# EAGLE design EuroESP32 (EAGLE 9.6.2)
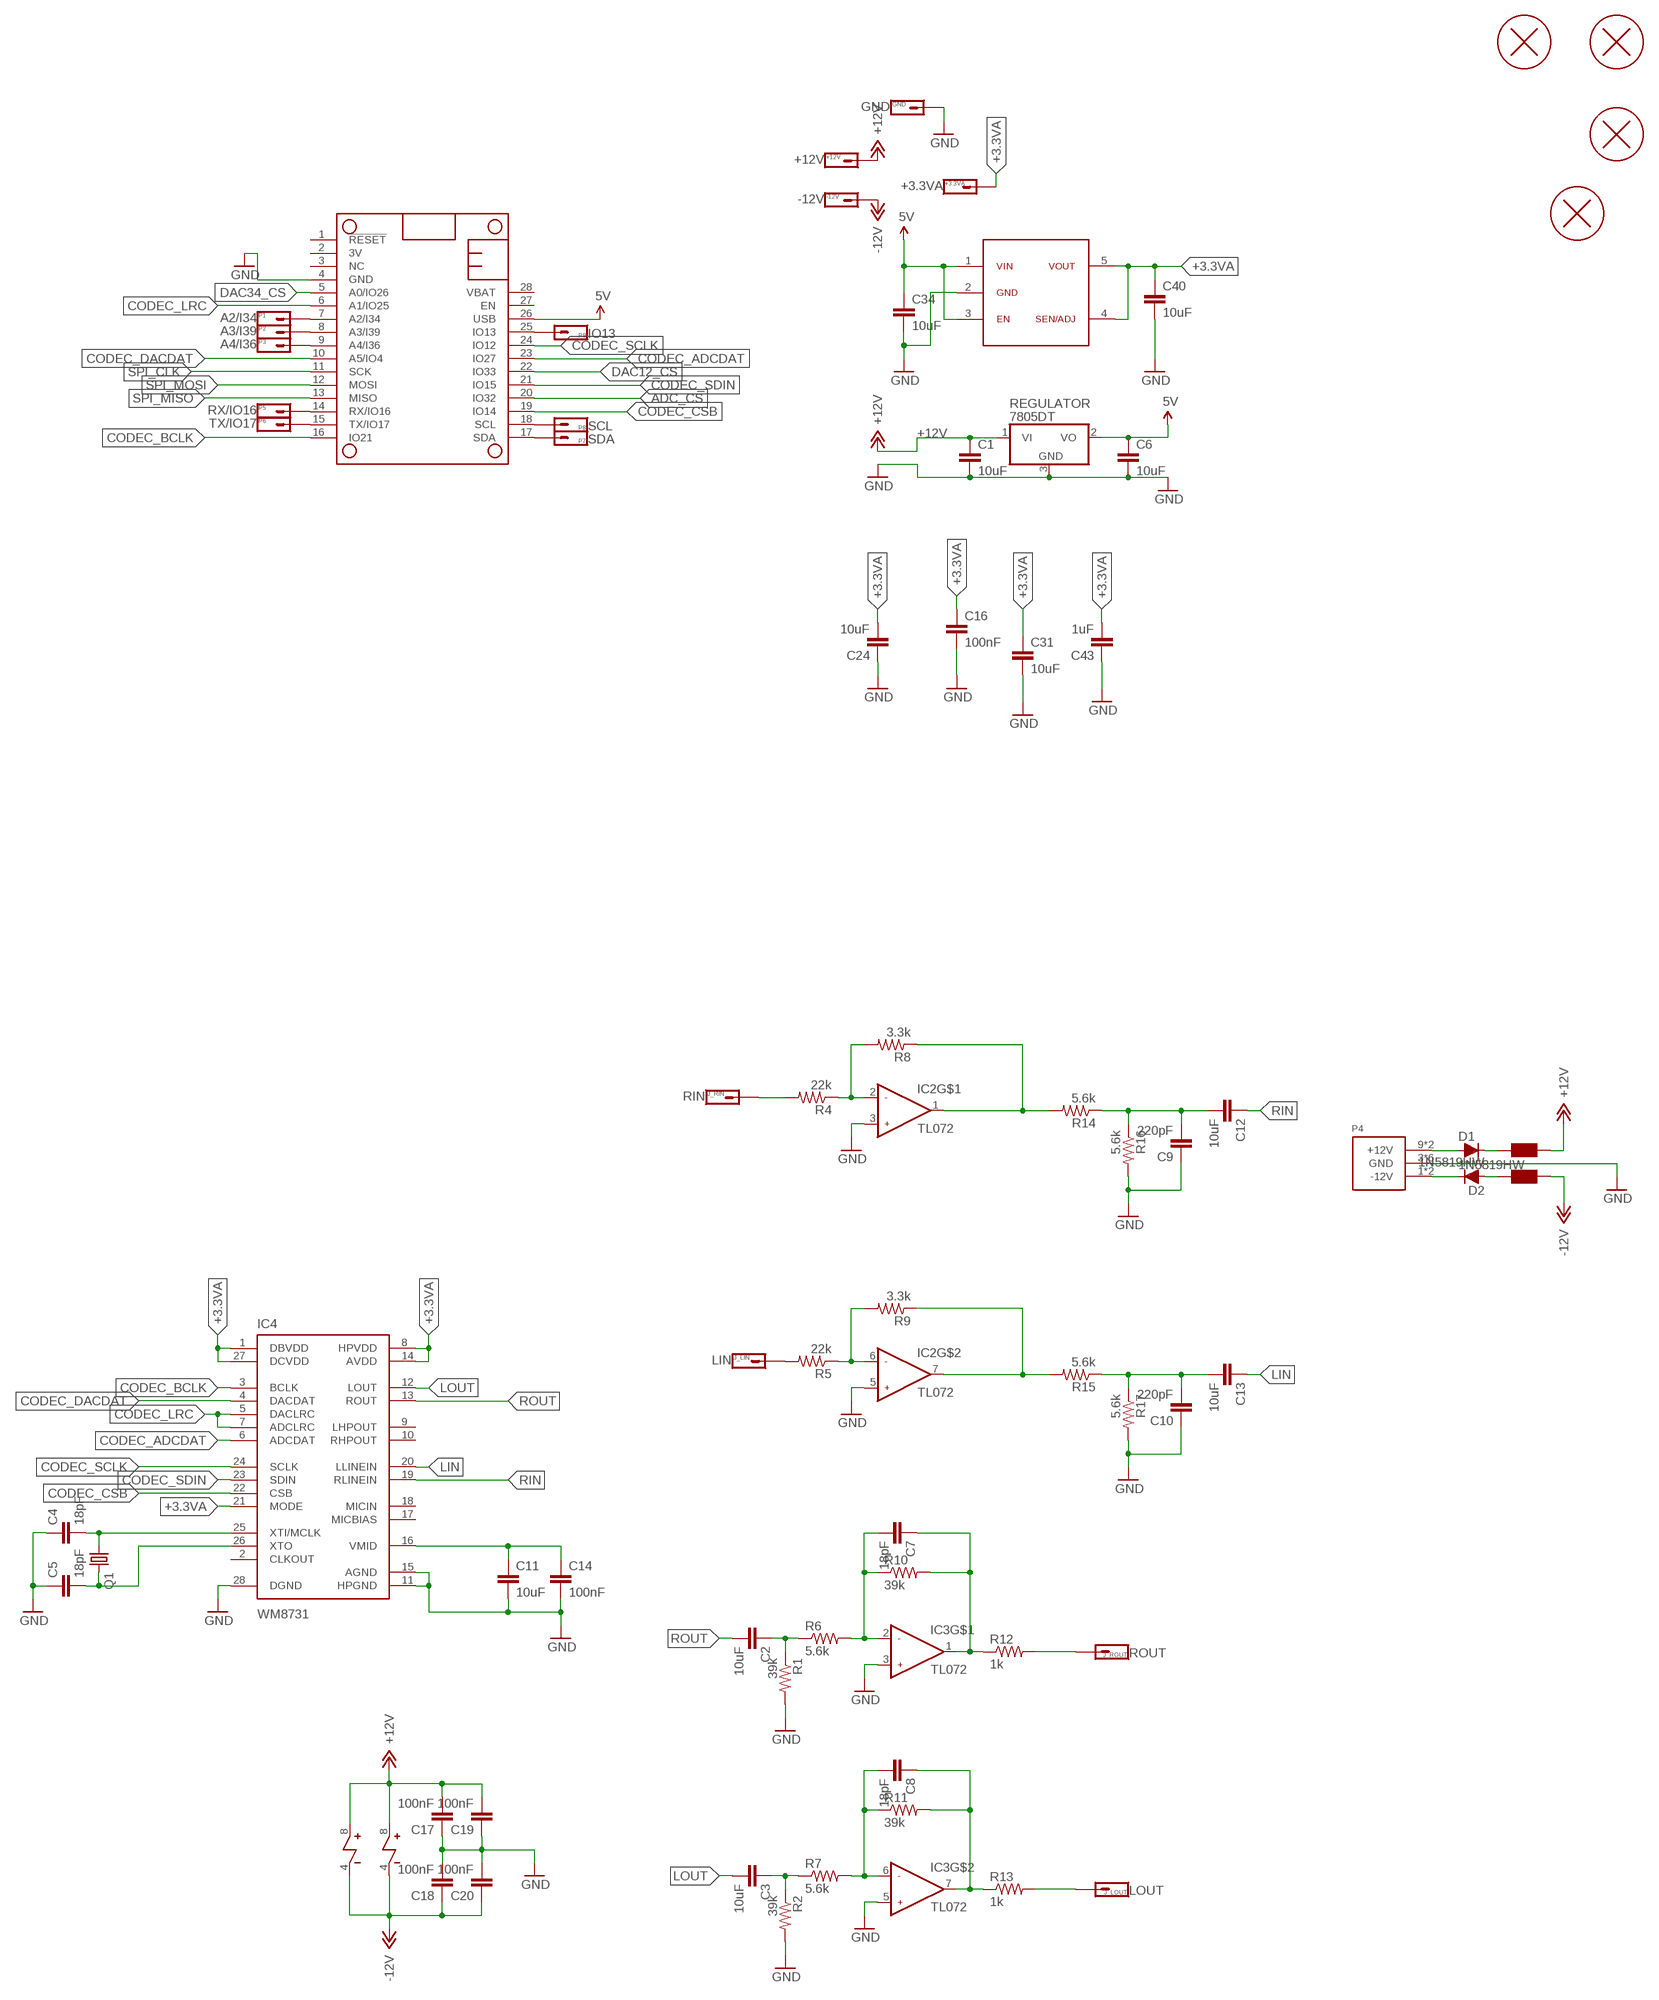
[diagram p0: schematic, sheet 1, part 1 of 2]
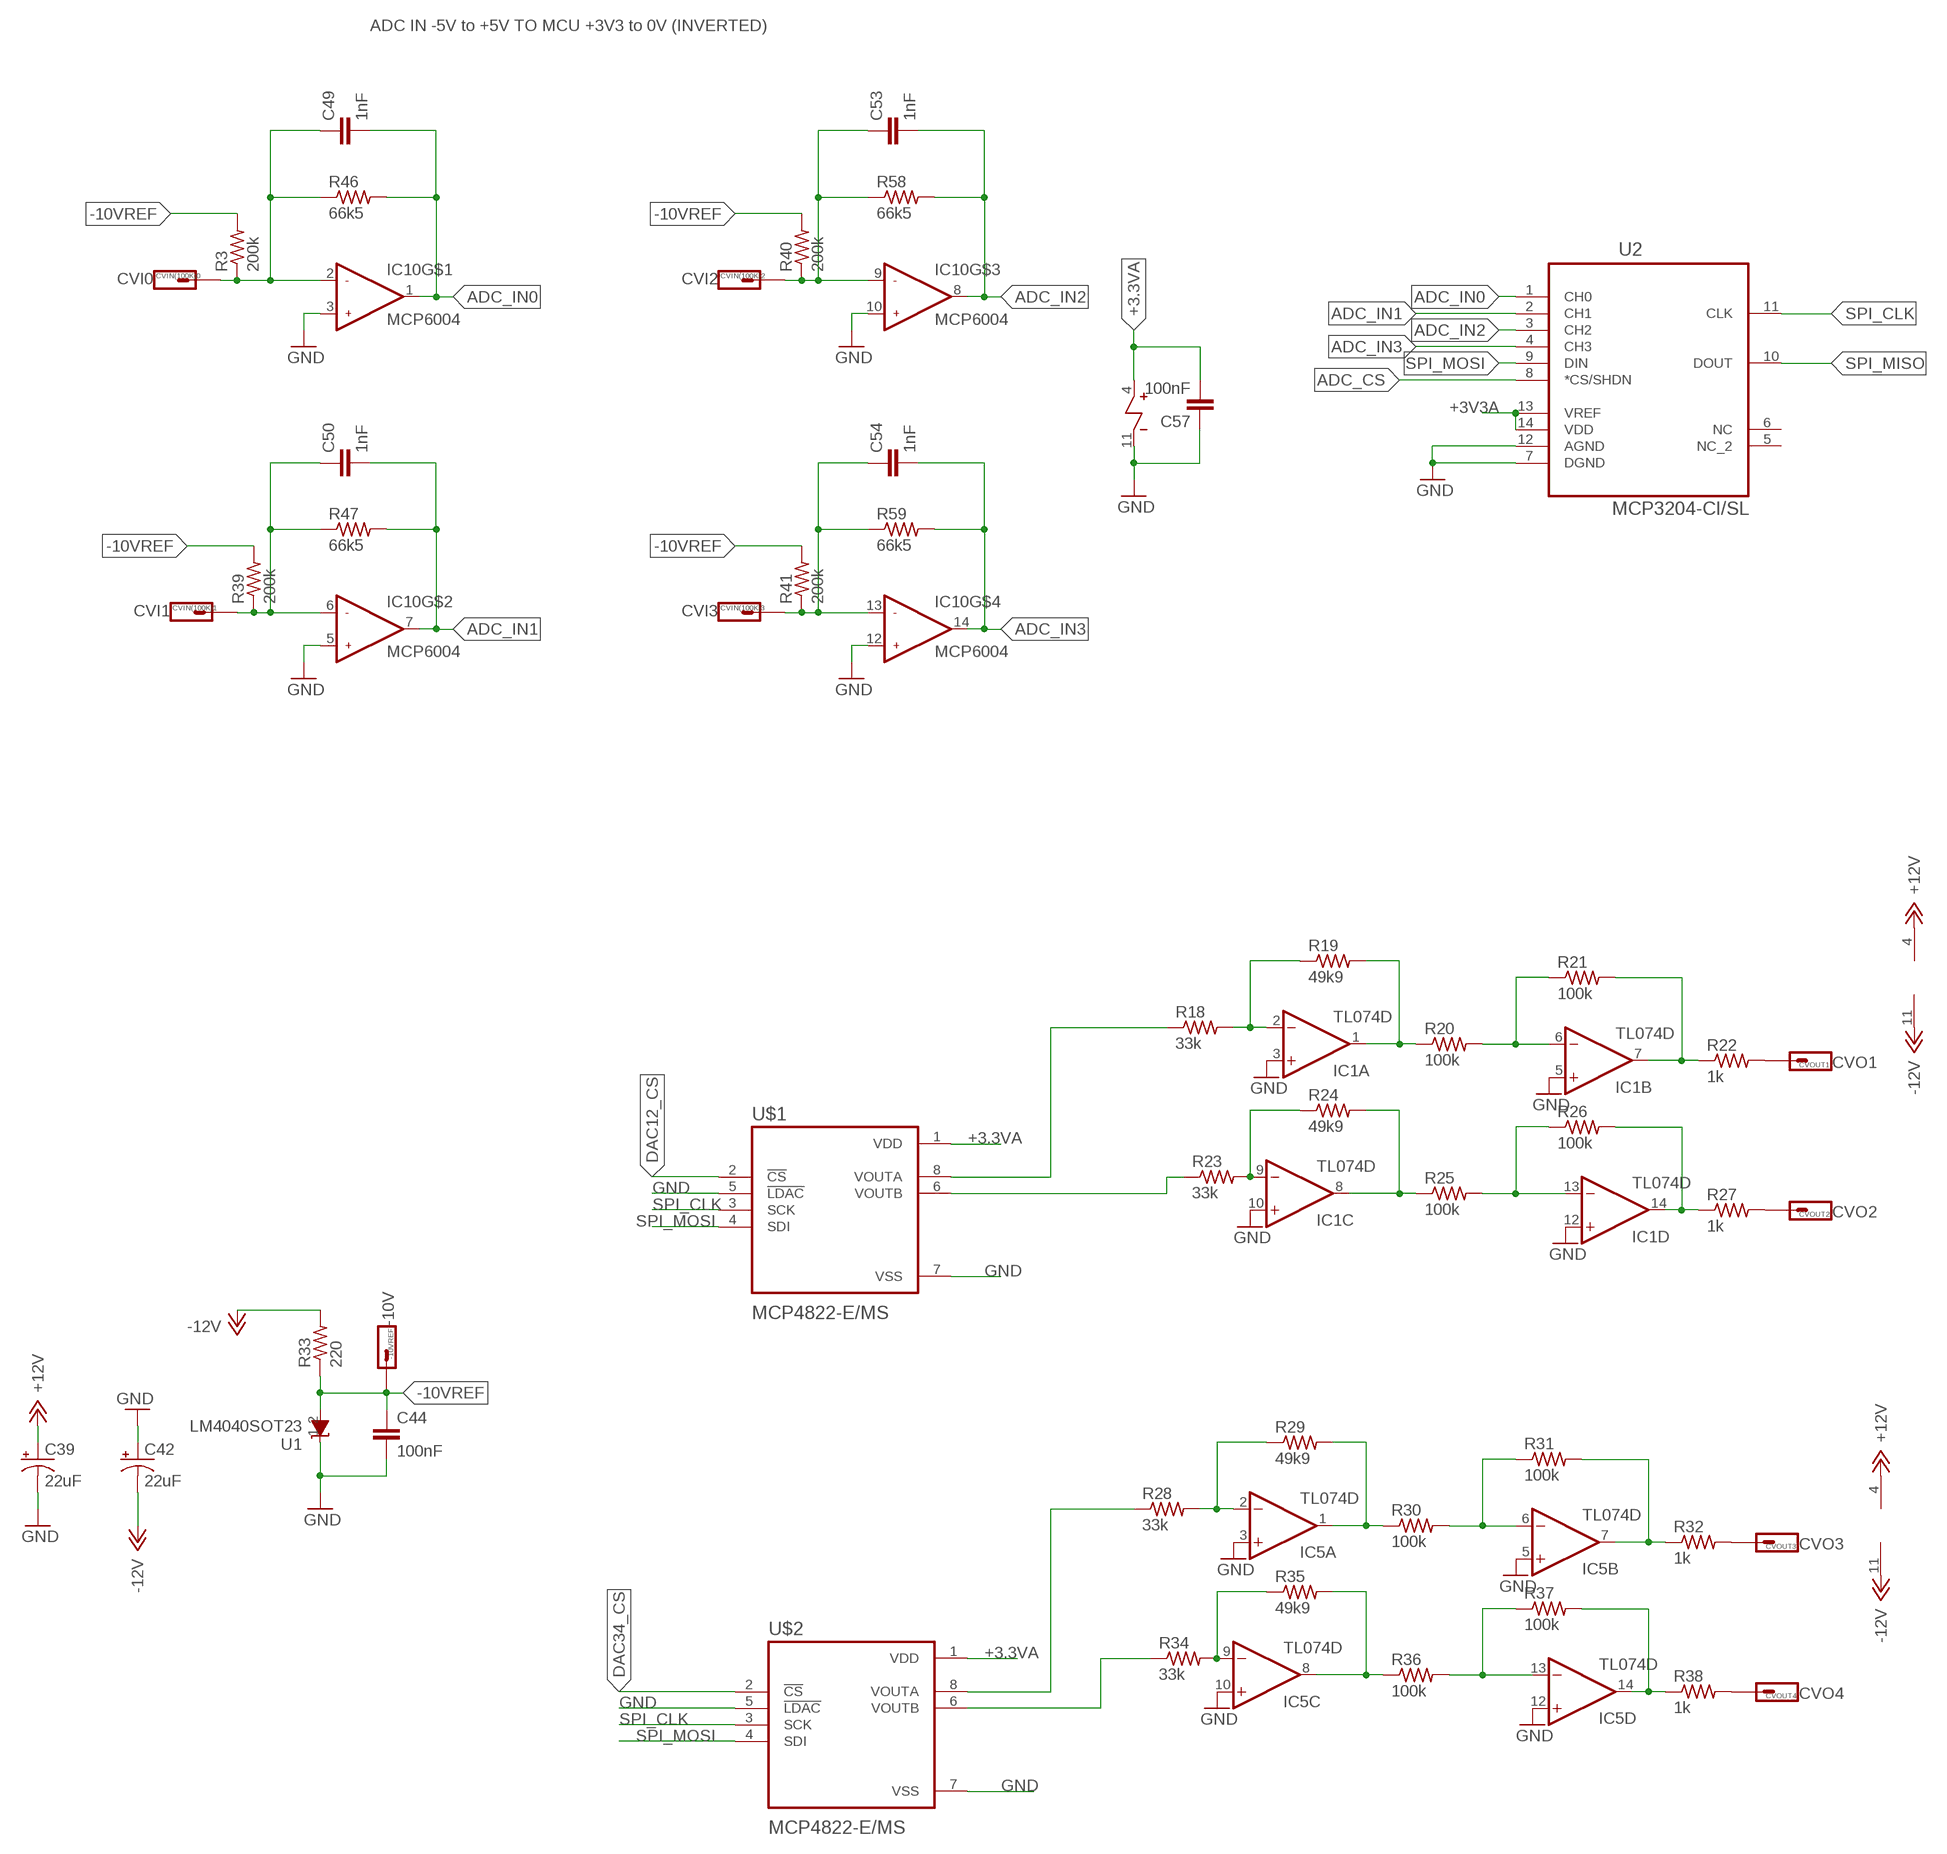
[diagram p1: schematic, sheet 1, part 2 of 2]

## Parts
+3.3VA  +3.3VA  HEADER-1X1  [1X01_SIDE_NAME]
+12V  +12V  HEADER-1X1  [1X01_SIDE_NAME]
-10VREF  -10V  HEADER-1X1  [1X01_SIDE_NAME]
-12V  -12V  HEADER-1X1  [1X01_SIDE_NAME]
C1  10uF  CAPACITOR1210  [R1210]
C2  10uF  CAPACITOR0805  [R0805]
C3  10uF  CAPACITOR0805  [R0805]
C4  18pF  CAPACITOR  [RESISTOR_0603]
C5  18pF  CAPACITOR  [RESISTOR_0603]
C6  10uF  CAPACITOR1210  [R1210]
C7  18pF  CAPACITOR  [RESISTOR_0603]
C8  18pF  CAPACITOR  [RESISTOR_0603]
C9  220pF  CAPACITOR  [RESISTOR_0603]
C10  220pF  CAPACITOR  [RESISTOR_0603]
C11  10uF  CAPACITOR0805  [R0805]
C12  10uF  CAPACITOR0805  [R0805]
C13  10uF  CAPACITOR0805  [R0805]
C14  100nF  CAPACITOR  [RESISTOR_0603]
C16  100nF  CAPACITOR  [RESISTOR_0603]
C17  100nF  CAPACITOR  [RESISTOR_0603]
C18  100nF  CAPACITOR  [RESISTOR_0603]
C19  100nF  CAPACITOR  [RESISTOR_0603]
C20  100nF  CAPACITOR  [RESISTOR_0603]
C24  10uF  CAPACITOR0805  [R0805]
C31  10uF  CAPACITOR0805  [R0805]
C34  10uF  CAPACITOR1210  [R1210]
C39  22uF  CAP_POL1206_TANT  [1206_POL]
C40  10uF  CAPACITOR0805  [R0805]
C42  22uF  CAP_POL1206_TANT  [1206_POL]
C43  1uF  CAPACITOR  [RESISTOR_0603]
C44  100nF  CAPACITOR  [RESISTOR_0603]
C49  1nF  CAPACITOR  [RESISTOR_0603]
C50  1nF  CAPACITOR  [RESISTOR_0603]
C53  1nF  CAPACITOR  [RESISTOR_0603]
C54  1nF  CAPACITOR  [RESISTOR_0603]
C57  100nF  CAPACITOR  [RESISTOR_0603]
CVIN(100K)0  CVI0  HEADER-1X1  [1X01_SIDE_NAME]
CVIN(100K)1  CVI1  HEADER-1X1  [1X01_SIDE_NAME]
CVIN(100K)2  CVI2  HEADER-1X1  [1X01_SIDE_NAME]
CVIN(100K)3  CVI3  HEADER-1X1  [1X01_SIDE_NAME]
CVOUT1  CVO1  HEADER-1X1  [1X01_SIDE_NAME]
CVOUT2  CVO2  HEADER-1X1  [1X01_SIDE_NAME]
CVOUT3  CVO3  HEADER-1X1  [1X01_SIDE_NAME]
CVOUT4  CVO4  HEADER-1X1  [1X01_SIDE_NAME]
D1  1N5819HW  DIODE  [SOD123]
D2  1N5819HW  DIODE  [SOD123]
F1  Würth Electronics 742792664  FERRITE-BEAD0805  [R0805]
F2  Würth Electronics 742792664  FERRITE-BEAD0805  [R0805]
GND  GND  HEADER-1X1  [1X01_SIDE_NAME]
H1  PCB_SCREW  [PCB_SCREW]
H3  PCB_SCREW  [PCB_SCREW]
H4  PCB_SCREW  [PCB_SCREW]
H5  PCB_SCREW  [PCB_SCREW]
IC1  TL074D  [SO14]
IC2  TL072  OPAMP_DUAL  [SOIC8]
IC3  TL072  OPAMP_DUAL  [SOIC8]
IC4  WM8731  [SSOP28]
IC5  TL074D  [SO14]
IC7  ADP7118  [SOT23-5L]
IC10  MCP6004  OPAMP_QUADPWR  [TSSOP14]
J_LIN  LIN  HEADER-1X1  [1X01_SIDE_NAME]
J_LOUT  LOUT  HEADER-1X1  [1X01_SIDE_NAME]
J_RIN  RIN  HEADER-1X1  [1X01_SIDE_NAME]
J_ROUT  ROUT  HEADER-1X1  [1X01_SIDE_NAME]
MS2  FEATHER_HUZZAH32NO_DRILL  [FEATHERWING_NODRILL]
P1  A2/I34  HEADER-1X1  [1X01_SIDE_NAME]
P2  A3/I39  HEADER-1X1  [1X01_SIDE_NAME]
P3  A4/I36  HEADER-1X1  [1X01_SIDE_NAME]
P4  POWER_SIMPLE10  [POWER_10]
P5  RX/IO16  HEADER-1X1  [1X01_SIDE_NAME]
P6  TX/IO17  HEADER-1X1  [1X01_SIDE_NAME]
P7  SDA  HEADER-1X1  [1X01_SIDE_NAME]
P8  SCL  HEADER-1X1  [1X01_SIDE_NAME]
P9  IO13  HEADER-1X1  [1X01_SIDE_NAME]
Q1  CRYSTAL  [HC49UP]
R1  39k  RESISTOR  [RESISTOR_0603]
R2  39k  RESISTOR  [RESISTOR_0603]
R3  200k  RESISTOR  [RESISTOR_0603]
R4  22k  RESISTOR  [RESISTOR_0603]
R5  22k  RESISTOR  [RESISTOR_0603]
R6  5.6k  RESISTOR  [RESISTOR_0603]
R7  5.6k  RESISTOR  [RESISTOR_0603]
R8  3.3k  RESISTOR  [RESISTOR_0603]
R9  3.3k  RESISTOR  [RESISTOR_0603]
R10  39k  RESISTOR  [RESISTOR_0603]
R11  39k  RESISTOR  [RESISTOR_0603]
R12  1k  RESISTOR  [RESISTOR_0603]
R13  1k  RESISTOR  [RESISTOR_0603]
R14  5.6k  RESISTOR  [RESISTOR_0603]
R15  5.6k  RESISTOR  [RESISTOR_0603]
R16  5.6k  RESISTOR  [RESISTOR_0603]
R17  5.6k  RESISTOR  [RESISTOR_0603]
R18  33k  RESISTOR  [RESISTOR_0603]
R19  49k9  RESISTOR  [RESISTOR_0603]
R20  100k  RESISTOR  [RESISTOR_0603]
R21  100k  RESISTOR  [RESISTOR_0603]
R22  1k  RESISTOR  [RESISTOR_0603]
R23  33k  RESISTOR  [RESISTOR_0603]
R24  49k9  RESISTOR  [RESISTOR_0603]
R25  100k  RESISTOR  [RESISTOR_0603]
R26  100k  RESISTOR  [RESISTOR_0603]
R27  1k  RESISTOR  [RESISTOR_0603]
R28  33k  RESISTOR  [RESISTOR_0603]
R29  49k9  RESISTOR  [RESISTOR_0603]
R30  100k  RESISTOR  [RESISTOR_0603]
R31  100k  RESISTOR  [RESISTOR_0603]
R32  1k  RESISTOR  [RESISTOR_0603]
R33  220  RESISTOR  [RESISTOR_0603]
R34  33k  RESISTOR  [RESISTOR_0603]
R35  49k9  RESISTOR  [RESISTOR_0603]
R36  100k  RESISTOR  [RESISTOR_0603]
R37  100k  RESISTOR  [RESISTOR_0603]
R38  1k  RESISTOR  [RESISTOR_0603]
R39  200k  RESISTOR  [RESISTOR_0603]
R40  200k  RESISTOR  [RESISTOR_0603]
R41  200k  RESISTOR  [RESISTOR_0603]
R46  66k5  RESISTOR  [RESISTOR_0603]
R47  66k5  RESISTOR  [RESISTOR_0603]
R58  66k5  RESISTOR  [RESISTOR_0603]
R59  66k5  RESISTOR  [RESISTOR_0603]
REGULATOR  7805DT  [TO252]
U1  LM4040SOT23  [SOT23]
U2  MCP3204-CI/SL  [SOIC127P600X175-14N]
U$1  MCP4822-E/MS  [SOP65P490X110-8N]
U$2  MCP4822-E/MS  [SOP65P490X110-8N]

## Nets
5V: C6.1 C34.1 IC7.1 IC7.3 MS2.26(USB) REGULATOR.2(VO)
+3.3VA: +3.3VA.1 C16.1 C24.2 C31.1 C40.1 C43.2 C57.2 IC4.1(DBVDD) IC4.8(HPVDD) IC4.14(AVDD) IC4.21(MODE) IC4.27(DCVDD) IC7.4 IC7.5 IC10.4 U$1.1(VDD) U$2.1(VDD)
+3V3A: U2.13(VREF) U2.14(VDD)
+12V: +12V.1 C1.1 C17.2 C19.2 C39.2(+) F1.1 IC1.4(P:V+) IC2.8 IC3.8 IC5.4(P:V+) REGULATOR.1(VI)
-10VREF: -10VREF.1 C44.1 R3.2 R33.1 R39.2 R40.2 R41.2 U1.2(A)
-12V: -12V.1 C18.1 C20.1 C42.1(-) F2.1 IC1.11(P:V-) IC2.4 IC3.4 IC5.11(P:V-) R33.2
ADC_CS: MS2.20(IO32) U2.8(*CS/SHDN)
ADC_IN0: C49.2 IC10.1 R46.2 U2.1(CH0)
ADC_IN1: C50.2 IC10.7 R47.2 U2.2(CH1)
ADC_IN2: C53.2 IC10.8 R58.2 U2.3(CH2)
ADC_IN3: C54.2 IC10.14 R59.2 U2.4(CH3)
CODEC_ADCDAT: IC4.6(ADCDAT) MS2.23(IO27)
CODEC_BCLK: IC4.3(BCLK) MS2.16(IO21)
CODEC_CSB: IC4.22(CSB) MS2.19(IO14)
CODEC_DACDAT: IC4.4(DACDAT) MS2.10(A5/IO4)
CODEC_LRC: IC4.5(DACLRC) IC4.7(ADCLRC) MS2.6(A1/IO25)
CODEC_SCLK: IC4.24(SCLK) MS2.24(IO12)
CODEC_SDIN: IC4.23(SDIN) MS2.21(IO15)
DAC12_CS: MS2.22(IO33) U$1.2(!CS)
DAC34_CS: MS2.5(A0/IO26) U$2.2(!CS)
DAC_B: R23.1 U$1.6(VOUTB)
DAC_D: R34.1 U$2.6(VOUTB)
GND: C1.2 C4.1 C5.1 C6.2 C9.1 C10.1 C11.2 C14.2 C16.2 C17.1 C18.2 C19.1 C20.2 C24.1 C31.2 C34.2 C39.1(-) C40.2 C42.2(+) C43.1 C44.2 C57.1 GND.1 IC1.3(A:+IN) IC1.5(B:+IN) IC1.10(C:+IN) IC1.12(D:+IN) IC2.3 IC2.5 IC3.3 IC3.5 IC4.11(HPGND) IC4.15(AGND) IC4.28(DGND) IC5.3(A:+IN) IC5.5(B:+IN) IC5.10(C:+IN) IC5.12(D:+IN) IC7.2 IC10.3 IC10.5 IC10.10 IC10.11 IC10.12 MS2.4(GND) P4.3(GND) P4.4(GND) P4.5(GND) P4.6(GND) P4.7(GND) P4.8(GND) R1.2 R2.2 R16.2 R17.2 REGULATOR.3(GND) U1.1(C) U2.7(DGND) U2.12(AGND) U$1.5(!LDAC) U$1.7(VSS) U$2.5(!LDAC) U$2.7(VSS)
LIN: C13.1 IC4.20(LLINEIN)
LOUT: C3.2 IC4.12(LOUT)
N$1: J_LIN.1 R5.2
N$2: J_LOUT.1 R13.2
N$3: J_ROUT.1 R12.2
N$4: IC1.2(A:-IN) R18.2 R19.1
N$5: IC1.7(B:OUT) R21.2 R22.1
N$6: IC1.9(C:-IN) R23.2 R24.1
N$7: MS2.7(A2/I34) P1.1
N$8: IC1.1(A:OUT) R19.2 R20.1
N$9: IC1.14(D:OUT) R26.2 R27.1
N$10: IC5.6(B:-IN) R30.2 R31.1
N$11: IC1.8(C:OUT) R24.2 R25.1
N$12: IC5.2(A:-IN) R28.2 R29.1
N$13: IC5.7(B:OUT) R31.2 R32.1
N$14: IC5.13(D:-IN) R36.2 R37.1
N$15: C53.1 CVIN(100K)2.1 IC10.9 R40.1 R58.1
N$16: IC5.1(A:OUT) R29.2 R30.1
N$17: C49.1 CVIN(100K)0.1 IC10.2 R3.1 R46.1
N$18: IC5.9(C:-IN) R34.2 R35.1
N$19: C50.1 CVIN(100K)1.1 IC10.6 R39.1 R47.1
N$20: IC5.14(D:OUT) R37.2 R38.1
N$21: C54.1 CVIN(100K)3.1 IC10.13 R41.1 R59.1
N$22: IC1.6(B:-IN) R20.2 R21.1
N$23: IC5.8(C:OUT) R35.2 R36.1
N$24: R18.1 U$1.8(VOUTA)
N$25: CVOUT1.1 R22.2
N$26: R28.1 U$2.8(VOUTA)
N$27: CVOUT2.1 R27.2
N$28: IC1.13(D:-IN) R25.2 R26.1
N$29: CVOUT3.1 R32.2
N$30: MS2.8(A3/I39) P2.1
N$31: J_RIN.1 R4.2
N$32: IC2.2 R4.1 R8.2
N$33: D1.+ P4.9(+12V) P4.10(+12V)
N$34: CVOUT4.1 R38.2
N$35: MS2.9(A4/I36) P3.1
N$36: IC2.1 R8.1 R14.2
N$37: C9.2 C12.2 R14.1 R16.1
N$38: MS2.14(RX/IO16) P5.1
N$39: MS2.15(TX/IO17) P6.1
N$40: IC2.6 R5.1 R9.2
N$41: MS2.17(SDA) P7.1
N$42: IC2.7 R9.1 R15.2
N$43: C5.2 IC4.26(XTO) Q1.2
N$44: C4.2 IC4.25(XTI/MCLK) Q1.1
N$45: C10.2 C13.2 R15.1 R17.1
N$46: C7.1 IC3.1 R10.2 R12.1
N$47: D1.- F1.2
N$48: C7.2 IC3.2 R6.2 R10.1
N$49: C2.1 R1.1 R6.1
N$50: MS2.18(SCL) P8.1
N$51: MS2.25(IO13) P9.1
N$53: D2.- P4.1(-12V) P4.2(-12V)
N$54: C8.1 IC3.7 R11.2 R13.1
N$55: C8.2 IC3.6 R7.2 R11.1
N$56: C11.1 C14.1 IC4.16(VMID)
N$57: C3.1 R2.1 R7.1
N$59: D2.+ F2.2
RIN: C12.1 IC4.19(RLINEIN)
ROUT: C2.2 IC4.13(ROUT)
SPI_CLK: MS2.11(SCK) U2.11(CLK) U$1.3(SCK) U$2.3(SCK)
SPI_MISO: MS2.13(MISO) U2.10(DOUT)
SPI_MOSI: MS2.12(MOSI) U2.9(DIN) U$1.4(SDI) U$2.4(SDI)
Unconnected: IC4.2(CLKOUT) IC4.9(LHPOUT) IC4.10(RHPOUT) IC4.17(MICBIAS) IC4.18(MICIN) MS2.1(!RESET) MS2.2(3V) MS2.3(NC) MS2.27(EN) MS2.28(VBAT) U2.5(NC_2) U2.6(NC)

## Notes on the sheet
- ADC IN -5V to +5V TO MCU +3V3 to 0V (INVERTED)

## Library data of the parts
+3.3VA +12V -10VREF -12V CVIN(100K)0 CVIN(100K)1-CVIN(100K)3 CVOUT1-CVOUT4 GND J_LIN J_LOUT J_RIN J_ROUT P1-P3 P5-P9 = TOF:HEADER-1X1: Header 1 Standard 1-pin 0.1" header. Use with straight break away headers (SKU : PRT-00116), right angle break away headers (PRT-00553), swiss pins (PRT-00743), machine pins (PRT-00117), and female headers (PRT-00115).
C1-C14 C16-C20 C24 C31 C34 C40 C43 C44 C49 C50 C53 C54 C57 = parts_aman:CAPACITOR
C39 C42 = parts_aman:CAP_POL
D1 D2 = parts_aman:DIODE
F1 F2 = parts_aman:FERRITE-BEAD
H1 H3-H5 = parts_aman:PCB_SCREW
IC1 IC5 = linear:TL074: OP AMP
IC2 IC3 = parts_aman:OPAMP_DUAL
IC4 = og-dac:WM8731
IC7 = parts_aman:ADP7118
IC10 = parts_aman:OPAMP_QUAD
MS2 = TOF:FEATHER_HUZZAH32
P4 = parts_aman:POWER_SIMPLE
Q1 = parts_aman:CRYSTAL
R1-R41 R46 R47 R58 R59 = parts_aman:RESISTOR
REGULATOR = linear:78*: Positive VOLTAGE REGULATOR Source: http://cache.national.com/ds/LM/LM78L05.pdf http://www.fairchildsemi.com/ds/LM/LM7805.pdf
U1 = parts_aman:LM4040
U2 = TOF:MCP3204-CI/SL: IC ADC 12BIT 2.7V 4CH SPI; MPN: MCP3204-CI/SL; OC_FARNELL: 1196795; OC_NEWARK: 26M1276; PACKAGE: 14 - SOIC; SUPPLIER: Microchip
U$1 U$2 = TOF:MCP4822-E/MS: Check prices <https://pricing.snapeda.com/parts/MCP4822-E/MS/Microchip%20Technology/view-part?ref=eda>; AVAILABILITY: Warning; DESCRIPTION: 12 Bit Digital to Analog Converter 2 8-MSOP; MF: Microchip Technology; MP: MCP4822-E/MS; PACKAGE: MSOP-8 Microchip; PRICE: None; PURCHASE-URL: https://pricing.snapeda.com/search/part/MCP4822-E/MS/?ref=eda

## Board
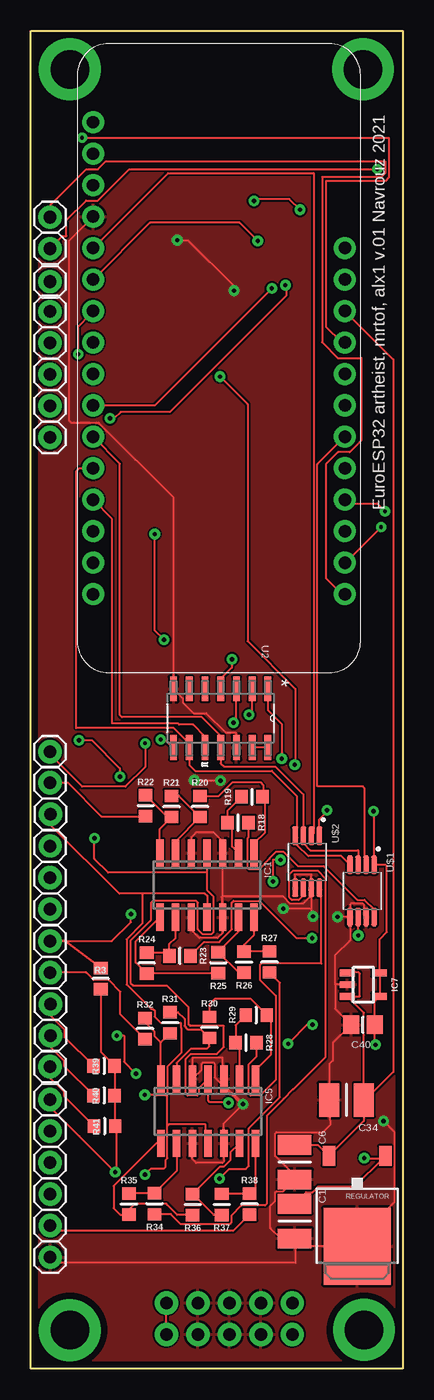
[diagram p2: board, top side]
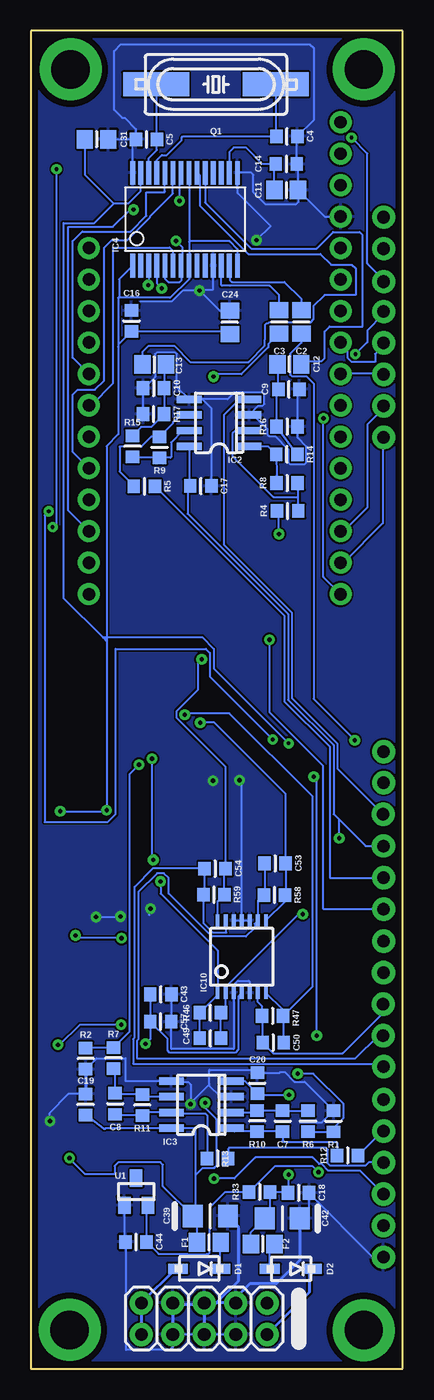
[diagram p3: board, bottom side, seen from below]

Size 30 x 108 mm. Coordinates in mm from the lower left corner, seen from the top.
Outline: 0,108 30,108 30,0 0,0 0,108
Copper layers (1*16): Top 0.035mm / dielectric 1.5mm / Bottom 0.035mm
Design rules "PCBCart-Standard *": minimum track width 6mil, minimum drill 12mil, track to track 6mil, track to pad 6mil, pad to pad 6mil, via to via 6mil, smd to smd 6mil, copper to edge 20mil, drill to drill 8mil, minimum pad ring 8mil, minimum via ring 10mil, stop-mask expansion 3mil, vias tented up to drill 25mil, thermal gap 8mil

### Footprints (pad centres in the part's own frame; a part is rotated, then mirrored left to right if it is on the bottom)
1X01_SIDE_NAME = drill 1.016 pad 1.88: 1 0,0
R1210 = smd 1.6 x 2.7: 1 -1.4,0; 2 1.4,0
R0805 = smd 1.3 x 1.5: 1 -0.95,0; 2 0.95,0
RESISTOR_0603 = smd 1 x 1.1: 1 -0.85,0; 2 0.85,0
1206_POL = smd 1.6 x 1.803: 1 -1.422,0; 2 1.422,0
SOD123 = smd 1.6 x 0.8: + 1.7,0; - -1.7,0
PCB_SCREW = drill 3.1 pad 5: P$1 0,0
SO14 = smd 0.6 x 2.2: 1 -3.81,-2.6; 2 -2.54,-2.6; 3 -1.27,-2.6; 4 0,-2.6; 5 1.27,-2.6; 6 2.54,-2.6; 7 3.81,-2.6; 8 3.81,2.6; 9 2.54,2.6; 10 1.27,2.6; 11 0,2.6; 12 -1.27,2.6; 13 -2.54,2.6; 14 -3.81,2.6
SOIC8 = smd 0.6 x 2: 1 -1.905,-2.419; 2 -0.635,-2.419; 3 0.635,-2.419; 4 1.905,-2.419; 5 1.905,2.42; 6 0.635,2.42; 7 -0.635,2.42; 8 -1.905,2.42
SSOP28 = smd 0.381 x 1.905: 1 -4.55,-3.752; 2 -3.9,-3.752; 3 -3.25,-3.752; 4 -2.6,-3.752; 5 -1.95,-3.752; 6 -1.3,-3.752; 7 -0.65,-3.752; 8 0,-3.752; 9 0.65,-3.752; 10 1.3,-3.752; 11 1.95,-3.752; 12 2.6,-3.752; 13 3.25,-3.752; 14 3.9,-3.752; 15 3.9,3.752; 16 3.25,3.752; 17 2.6,3.752; 18 1.95,3.752; 19 1.3,3.752; 20 0.65,3.752; 21 0,3.752; 22 -0.65,3.752; 23 -1.3,3.752; 24 -1.95,3.752; 25 -2.6,3.752; 26 -3.25,3.752; 27 -3.9,3.752; 28 -4.55,3.752
SOT23-5L = smd 0.55 x 1.2: 1 -0.95,-1.3; 2 0,-1.3; 3 0.95,-1.3; 4 0.95,1.3; 5 -0.95,1.3
TSSOP14 = smd 0.305 x 0.991: 1 -1.95,-2.918; 2 -1.3,-2.918; 3 -0.65,-2.918; 4 0,-2.918; 5 0.65,-2.918; 6 1.3,-2.918; 7 1.95,-2.918; 8 1.95,2.918; 9 1.3,2.918; 10 0.65,2.918; 11 0,2.918; 12 -0.65,2.918; 13 -1.3,2.918; 14 -1.95,2.918
FEATHERWING_NODRILL = drill 1 pad 1.778: 1 6.35,1.27; 2 8.89,1.27; 3 11.43,1.27; 4 13.97,1.27; 5 16.51,1.27; 6 19.05,1.27; 7 21.59,1.27; 8 24.13,1.27; 9 26.67,1.27; 10 29.21,1.27; 11 31.75,1.27; 12 34.29,1.27; 13 36.83,1.27; 14 39.37,1.27; 15 41.91,1.27; 16 44.45,1.27; 17 44.45,21.59; 18 41.91,21.59; 19 39.37,21.59; 20 36.83,21.59; 21 34.29,21.59; 22 31.75,21.59; 23 29.21,21.59; 24 26.67,21.59; 25 24.13,21.59; 26 21.59,21.59; 27 19.05,21.59; 28 16.51,21.59
POWER_10 = drill 1.016 pad 1.88: 1 -5.08,-1.27; 2 -5.08,1.27; 3 -2.54,-1.27; 4 -2.54,1.27; 5 0,-1.27; 6 0,1.27; 7 2.54,-1.27; 8 2.54,1.27; 9 5.08,-1.27; 10 5.08,1.27
HC49UP = smd 5.334 x 1.93: 1 -4.826,0; 2 4.826,0
TO252 = smd 1 x 1.6: 1 -2.28,-4.8; 2 2.28,-4.8 | smd 5.4 x 6.2: 3 0,2.5
SOT23 = smd 1 x 1.4: 1 -0.95,-1.1; 2 0.95,-1.1; 3 0,1.1
SOIC127P600X175-14N = smd 1.981 x 0.559: 1 -2.362,3.81; 2 -2.362,2.54; 3 -2.362,1.27; 4 -2.362,0; 5 -2.362,-1.27; 6 -2.362,-2.54; 7 -2.362,-3.81; 8 2.362,-3.81; 9 2.362,-2.54; 10 2.362,-1.27; 11 2.362,0; 12 2.362,1.27; 13 2.362,2.54; 14 2.362,3.81
SOP65P490X110-8N = smd 1.5 x 0.49: 1 -2.105,0.975; 2 -2.105,0.325; 3 -2.105,-0.325; 4 -2.105,-0.975; 5 2.105,-0.975; 6 2.105,-0.325; 7 2.105,0.325; 8 2.105,0.975

### Placement (x,y rotation side)
+3.3VA  1.53,49.81 180 top
+12V  1.55,42.19 180 top
-10VREF  1.53,21.71 180 top
-12V  1.57,44.75 180 top
C1  21.28,11.9 270 top
C2  8.18,84.51 90 bottom
C3  9.97,84.51 90 bottom
C4  9.34,99.48 180 bottom
C5  20.68,99.24 0 bottom
C6  21.28,16.66 270 top
C7  9.69,19.97 90 bottom
C8  23.2,21.38 90 bottom
C9  9.18,79.06 180 bottom
C10  20.1,79.16 0 bottom
C11  9.39,95.15 0 bottom
C12  9.15,81.09 180 bottom
C13  20.05,81.07 0 bottom
C14  9.39,97.25 0 bottom
C16  21.89,84.58 90 bottom
C17  16.29,71.26 180 bottom
C18  8.4,14.19 0 bottom
C19  25.59,21.32 270 bottom
C20  11.73,23.03 90 bottom
C24  13.95,84.48 270 bottom
C31  24.7,99.25 0 bottom
C34  25.47,21.68 180 top
C39  15.53,12.31 180 bottom
C40  26.79,27.75 180 top
C42  9.71,12.12 0 bottom
C43  19.52,30.21 180 bottom
C44  21.52,10.22 180 bottom
C49  15.53,26.67 180 bottom
C50  10.45,26.32 0 bottom
C53  10.3,40.79 0 bottom
C54  15.13,40.36 0 bottom
C57  19.53,28 180 bottom
CVIN(100K)0  1.53,34.51 180 top
CVIN(100K)1  1.57,29.43 180 top
CVIN(100K)2  1.57,26.87 180 top
CVIN(100K)3  1.53,24.37 180 top
CVOUT1  1.53,47.31 180 top
CVOUT2  1.55,14.09 180 top
CVOUT3  1.55,31.97 180 top
CVOUT4  1.55,11.55 180 top
D1  16.43,8.06 180 bottom
D2  9.02,8.04 180 bottom
F1  15.64,10.2 0 bottom
F2  11.29,10.06 0 bottom
GND  1.55,8.99 180 top
H1  26.88,3.12 270 top
H3  3.14,104.9 270 top
H4  3.14,3.1 270 top
H5  26.8,104.9 270 top
IC1  14.21,39.04 180 top
IC2  14.81,76.37 90 bottom
IC3  16.24,21.3 90 bottom
IC4  17.24,92.8 0 bottom
IC5  14.3,20.78 180 top
IC7  26.84,31 270 top
IC10  12.99,33.25 0 bottom
J_LIN  1.53,39.63 180 top
J_LOUT  1.53,16.63 180 top
J_RIN  1.53,37.09 180 top
J_ROUT  1.53,19.17 180 top
MS2  3.74,106.98 270 top
P1  1.53,85.34 0 top
P2  1.53,82.8 0 top
P3  1.53,80.26 0 top
P4  16.02,4.03 180 bottom
P5  1.53,77.72 0 top
P6  1.53,75.18 0 top
P7  1.53,92.96 0 top
P8  1.53,90.42 0 top
P9  1.53,87.76 0 top
Q1  15.07,103.69 180 bottom
R1  5.58,19.96 90 bottom
R2  25.59,25.02 270 bottom
R3  5.63,31.48 270 top
R4  9.28,69.24 180 bottom
R5  20.85,71.24 0 bottom
R6  7.63,19.98 90 bottom
R7  23.33,25.07 270 bottom
R8  9.33,71.5 0 bottom
R9  19.63,74.39 90 bottom
R10  11.74,19.98 270 bottom
R11  21.01,21.28 270 bottom
R12  4.45,17.21 0 bottom
R13  14.94,16.96 0 bottom
R14  9.35,73.81 180 bottom
R15  21.81,74.47 270 bottom
R16  9.33,76.06 0 bottom
R17  20.1,77.06 180 bottom
R18  16.72,44.07 180 top
R19  17.83,46.16 0 top
R20  13.64,45.38 270 top
R21  11.35,45.38 270 top
R22  9.26,45.43 270 top
R23  12.02,33.32 180 top
R24  9.34,32.73 270 top
R25  15.12,32.77 90 top
R26  17.2,32.82 90 top
R27  19.25,32.83 270 top
R28  17.36,26.31 180 top
R29  18.18,28.54 0 top
R30  14.4,27.54 270 top
R31  11.23,27.91 270 top
R32  9.2,27.46 270 top
R33  11.54,14.26 0 bottom
R34  9.97,13.31 90 top
R35  7.91,13.27 270 top
R36  13.05,13.24 90 top
R37  15.4,13.26 90 top
R38  17.63,13.28 270 top
R39  5.9,24.43 0 top
R40  5.9,22.05 0 top
R41  5.95,19.57 0 top
R46  15.53,28.72 180 bottom
R47  10.5,28.47 0 bottom
R58  10.35,38.23 0 bottom
R59  15.23,38.27 0 bottom
REGULATOR  26.33,12.37 180 top
U1  21.51,14.28 0 bottom
U2  15.32,52.51 270 top
U$1  26.73,38.57 270 top
U$2  22.31,40.92 270 top

### Tracks (layer width: path | path; a pad name or v marks a point on that pad's centre or on a via)
5V
  Top 0.152: IC7.1 25.58,32 26.44,32 26.54,31.9 26.54,30.05 IC7.3 26.86,28.73 26.86,26.91 26.87,26.9 C34.1 26.87,21.56 | MS2.26 29.25,81.47 29.25,23.94 26.87,21.56 | C6.1 23.16,18.06 REGULATOR.2 26.87,19.99 26.87,21.56
+3.3VA  (via drill 0.3, 0.35)
  Top 0.152: U$2.1 23.28,44.34 23.89,44.95 v23.89,45.07 | v27.64,45 27.59,44.95 27.59,44.85 27.7,44.74 U$1.1 28.63,40.67 28.72,40.58 28.72,35.24 28.14,34.66 IC7.5 IC7.4 27.74,29.66 C40.1 27.74,26.22 v27.82,26.14 | v20.76,26.22 22.4,27.86 22.7,27.86 22.72,27.84 v22.72,27.76 | v9.21,50.48 9.21,48.58 7.62,46.99 4.13,46.99 1.59,49.53 +3.3VA.1
  Bottom 0.152: IC4.27 21.14,95.08 22.15,94.07 23.31,94.07 | C43.2 C57.2 | 22.94,82.48 22.94,82.68 C16.1 14.15,83.73 C24.2 | 22.94,82.48 22.94,75.43 23.89,74.48 23.89,58.72 | 23.89,58.72 v23.89,45.07 23.96,45 v27.64,45 | IC4.14 13.34,90.4 13.96,91.02 17.18,91.02 17.24,90.96 | IC4.21 17.24,90.96 | 17.24,90.96 IC4.8 17.24,87.98 18.76,86.46 22.88,86.46 | 22.88,86.46 22.96,86.46 22.96,82.5 22.94,82.48 | 22.88,86.46 22.88,87.96 IC4.1 | 24.18,59.01 27.38,62.21 27.38,92.5 24.88,92.5 23.31,94.07 | 24.18,59.01 23.89,58.72 | IC10.4 13.26,30.07 13.26,25.76 13.52,25.5 18.8,25.5 18.98,25.67 18.98,26.6 C57.2 | C57.2 20.38,26.58 20.74,26.22 v20.76,26.22 | v22.72,27.76 26.06,27.76 27.7,26.12 27.8,26.12 v27.82,26.14 | C31.1 25.66,96.41 23.31,94.07 | v9.21,50.48 15.24,56.52 15.24,58.1 16.19,59.05 24.13,59.05 24.18,59.01
+3V3A
  Top 0.152: U2.14 U2.13
+12V  (via drill 0.35)
  Top 0.152: v15.94,21.45 15.89,21.5 14.44,21.5 14.3,21.64 IC5.4 13.56,22.64 13.56,22.18 13.42,22.05 12.63,22.05 12.5,22.18 12.5,24.99 12.91,25.41 15.01,25.41 15.56,25.96 15.56,27.66 12.84,27.66 12.71,27.8 12.71,29.18 10.97,30.92 8.24,30.92 8.02,31.14 8.02,34.54 9.68,36.2 9.68,37.6 9.82,37.74 9.97,37.74 10,37.77 13.33,37.77 13.47,37.63 13.47,35.46 13.81,35.11 14.6,35.11 14.74,35.24 14.74,38.08 14.21,38.61 IC1.4 14.21,40.07 14.19,40.05 6.23,40.05 5.12,41.16 v5.12,42.82 | C1.1 22.21,14.23 22.73,14.23 23.19,14.7 26.14,14.7 28.42,16.98 | v26.9,16.98 28.42,16.98 | 28.42,16.98 REGULATOR.1
  Bottom 0.152: F1.1 16.59,11.96 C39.2 | C19.2 24.11,19.35 24.04,19.35 23.99,19.4 IC3.8 18.61,19.45 16.69,19.45 16.69,15.65 | C39.2 16.69,12.57 16.69,15.65 | 16.69,15.65 16.16,16.18 15.2,16.18 15.06,16.32 15.06,20.15 15.94,21.03 v15.94,21.45 | IC2.8 17.23,71.35 C17.2 17.36,71.04 17.36,69.03 9.24,60.91 9.24,54 5.58,50.34 5.58,44.77 5.12,44.32 | +12V.1 2.99,42.19 5.12,44.32 | v5.12,42.82 5.12,44.32 | C39.2 19.36,14.73 19.36,16.46 19.56,16.66 22.94,16.66 23.24,16.36 23.24,15.7 25.62,15.7 v26.9,16.98
-10VREF  (via drill 0.35)
  Top 0.152: -10VREF.1 1.53,21.13 3.9,18.76 v6.8,15.86 6.88,15.94 6.88,19.49 R41.2 6.75,19.62 R40.2 R39.2 5.63,25.55 R3.2
  Bottom 0.152: U1.2 20.67,13.06 C44.1 19.7,9.25 17.37,9.25 17.34,9.22 15.85,9.22 15.82,9.25 15.69,9.25 15.59,9.35 15.59,13 14.33,14.26 R33.1 10.28,16.36 7.3,16.36 v6.8,15.86
-12V  (via drill 0.35)
  Top 0.152: -12V.1 1.57,43.91 7.13,38.35 9,38.35 | 9,38.35 14.04,38.35 14.21,38.18 IC1.11 | IC5.11 14.09,18.39 14.09,19.7 11.14,19.7 11.02,19.58 | 11.02,19.58 11.02,16.98 10.84,16.81 10.84,16.25 10.73,16.14 9.68,16.14 v9.2,15.66 | 9,38.35 9,35.95 7.71,34.67 7.71,31.01 9.69,29.04 9.85,29.04 9.98,28.9 9.98,28.4 10.46,27.92 12.06,27.92 12.1,27.88 12.1,27.55 12.14,27.5 12.14,25.49 11.02,24.37 11.02,22.18 | 11.02,22.18 10.88,22.05 10.09,22.05 10.04,22.1 v9.18,22.1 | 11.02,19.58 11.02,22.18
  Bottom 0.152: F2.1 12.24,11.02 C42.1 10.7,12.57 R33.2 9.32,14.26 C18.1 9.25,15.71 v9.2,15.66 | v9.18,22.1 9.2,22.12 11.66,22.12 C20.1 12.76,23.21 IC3.4 | IC2.4 13.15,78.27 14.42,77 14.42,66.52 8.94,61.03 8.94,54.13 5.27,50.46 5.27,48.45 -12V.1
ADC_CS  (via drill 0.3)
  Top 0.152: v10.48,50.8 10.79,50.8 11.43,50.16 U2.8 | v28.57,69.22 27.94,69.85 25.4,69.85 MS2.20
  Bottom 0.152: v10.48,50.8 15.56,55.88 15.56,57.78 15.88,58.1 23.18,58.1 23.18,44.77 23.81,44.13 28.89,44.13 28.89,68.9 v28.57,69.22
ADC_IN0  (via drill 0.35)
  Top 0.152: U2.1 19.13,53.16 20.24,52.05 v20.24,49.25 | v20.13,41.07 19.54,41.07 v19.54,39.33
  Bottom 0.152: C49.2 R46.2 14.94,30.16 IC10.1 14.94,33.75 19.54,38.35 v19.54,39.33 | v20.24,49.25 20.24,41.18 v20.13,41.07
ADC_IN1  (via drill 0.35)
  Top 0.152: v17.59,52.8 17.86,53.07 U2.2
  Bottom 0.152: R47.2 9.65,28.94 IC10.7 | R47.2 7.27,30.85 7.27,46.18 13.99,52.9 17.49,52.9 v17.59,52.8 | R47.2 9.65,26.37 C50.2
ADC_IN2  (via drill 0.35)
  Top 0.152: v16.34,52.15 16.59,52.4 U2.3
  Bottom 0.152: IC10.8 9.5,37.71 R58.2 9.45,38.28 C53.2 9.45,46.41 15.19,52.15 v16.34,52.15
ADC_IN3  (via drill 0.35)
  Top 0.152: v16.22,57.28 16.22,56.6 15.32,55.7 U2.4
  Bottom 0.152: IC10.14 14.94,37.72 R59.2 14.38,40.26 C54.2 14.28,48.56 18.25,52.53 18.25,53.07 16.5,54.82 16.5,57.28 v16.22,57.28
CODEC_ADCDAT
  Bottom 0.152: MS2.23 25.15,77.77 23.36,79.56 23.36,90.51 18.8,90.51 18.54,90.25 IC4.6
CODEC_BCLK  (via drill 0.35)
  Top 0.152: v20.53,87.48 20.63,87.38 20.63,86.66 11.2,77.23 7.24,77.23 6.74,76.73 v6.39,76.73
  Bottom 0.152: IC4.3 20.49,87.83 20.63,87.69 20.63,87.58 v20.53,87.48 | MS2.16 6.39,63.91 v6.39,76.73
CODEC_CSB  (via drill 0.35)
  Top 0.152: v21.73,93.56 20.86,94.43 18.17,94.43 v18.01,94.27
  Bottom 0.152: MS2.19 26.99,69.27 26.99,92.18 23.39,92.18 22,93.56 v21.73,93.56 | v18.01,94.27 18.01,96.43 IC4.22
CODEC_DACDAT  (via drill 0.35)
  Top 0.152: v19.44,87.22 v19.45,87.21 10.01,77.77 MS2.10
  Bottom 0.152: v19.44,87.22 19.84,87.62 IC4.4
CODEC_LRC  (via drill 0.35)
  Top 0.152: v18.3,91.06 16.84,92.52 9.6,92.52 MS2.6
  Bottom 0.152: IC4.5 19.19,88.01 18.9,87.72 18,87.72 17.84,87.88 17.84,89 IC4.7 17.76,89.18 17.76,90.52 v18.3,91.06
CODEC_SCLK
  Bottom 0.152: IC4.24 19.19,95.03 19.24,94.98 20.69,94.98 20.69,93.08 21.96,91.81 25.86,91.81 26.64,91.03 26.64,81.62 MS2.24
CODEC_SDIN
  Bottom 0.152: MS2.21 26.64,74 26.64,78.63 26.24,79.03 24.84,79.03 24.09,79.78 24.09,90.49 23.46,91.12 22.22,91.12 20.39,92.95 20.39,93.03 18.54,94.88 IC4.23
DAC12_CS
  Top 0.152: MS2.22 23.11,73.01 23.11,47.01 26.78,47.01 26.94,46.85 26.94,40.78 U$1.2
DAC34_CS
  Top 0.152: MS2.5 11.07,96.53 22.81,96.53 22.81,43.2 U$2.2
DAC_B  (via drill 0.35)
  Top 0.152: R23.1 14,34.45 15.21,34.45 16.22,35.46 16.22,37.63 16.35,37.77 18.41,37.77 21.43,34.75 v22.7,34.75 | v26.41,34.98 v26.4,34.99 U$1.6
  Bottom 0.152: v22.7,34.75 26.34,34.75 26.49,34.9 v26.41,34.98
DAC_D
  Top 0.152: R34.1 11.29,12.46 12.09,11.66 16.03,11.66 16.18,11.81 16.18,12.35 16.99,13.16 18.9,13.16 19.04,13.3 19.04,20.42 20.39,21.77 20.39,21.8 21.14,22.54 21.16,22.54 23.75,25.13 23.75,39.58 23.13,40.2 21.16,40.2 20.86,39.9 20.86,38.04 21.06,37.83 21.6,37.83 21.98,38.21 U$2.6
GND  (via drill 0.35)
  Top 0.152: v11.8,91.11 12.66,91.11 16.39,87.38 v16.39,87.03 | IC1.3 15.48,41.7 | 15.48,41.7 15.48,42.56 14.74,43.3 13.34,43.3 12.94,42.9 IC1.5 | IC1.12 15.48,35.19 15.04,34.75 13.59,34.75 12.94,35.4 IC1.10 | U$2.7 22.63,39.85 | 22.63,39.85 22.63,39.89 22.64,39.9 | 22.63,39.85 22.58,39.9 21.29,39.9 21.29,38.85 U$2.5 | U$1.7 26.89,36.62 26.89,37.44 26.78,37.55 25.84,37.55 25.75,37.46 U$1.5 | U$2.7 22.45,38.63 22.45,38.04 21.94,37.53 20.94,37.53 20.36,38.1 15.44,38.1 15.39,38.05 15.39,36.53 IC1.12 | IC1.12 15.48,40.94 15.49,40.95 15.49,41.69 15.48,41.7 | MS2.4 3.09,91.09 3.09,76.53 3.27,76.35 5.47,76.35 11.51,70.32 U2.7 12.27,54.11 12.27,53.78 13.15,52.91 14.15,52.91 15.71,51.34 16.5,51.34 16.59,51.25 U2.12 | IC5.10 13.03,16.91 13.34,16.6 15.44,16.6 15.57,16.73 IC5.12 15.57,19.81 v17.12,21.36 | 24.08,21.55 24.19,19.71 23.57,19.09 19.84,19.09 19.7,18.95 19.7,17.16 21.28,15.59 C6.2 20.35,14.33 19.84,14.33 19.7,14.2 19.7,13.53 19.32,13.15 19.32,11.34 20.16,10.5 C1.2 | 24.08,21.55 C34.2 | IC7.2 24.64,31 | 24.64,31 24.54,31 24.54,29.05 C40.2 24.36,26.28 24.36,24.88 24.08,24.59 24.08,21.55 | U$1.5 v24.74,36.46 | v22.77,36.5 22.63,36.64 22.63,37.18 | U$2.7 22.63,37.18 | v20.36,37.14 22.59,37.14 22.63,37.18 | v13.18,47.5 15.32,47.5 15.34,47.48 v15.31,47.45 | C1.2 21.91,9.87 REGULATOR.3 26.33,10.43 29.34,13.44 29.34,19.1 v28.46,19.98 | v17.12,21.36 16.96,21.36 14.83,23.49 14.83,24.57 14.69,24.71 13.9,24.71 13.77,24.57 13.77,24.12 IC5.5 13.03,25.09 13.04,25.1 15.44,25.1 15.44,23.51 IC5.3 15.57,22.91 v17.12,21.36 | U$1.5 25.75,34.57 24.52,33.34 24.52,31.12 24.64,31 | C1.2 21.34,10.44 21.34,8.52 2.02,8.52 GND.1
  Bottom 0.152: C5.1 21.54,100.08 22.44,100.98 22.64,100.98 23.29,101.63 23.29,106.37 22.74,106.92 7.48,106.92 7.19,106.63 7.19,100.78 C4.1 8.54,99.43 C14.2 8.45,97.16 C11.2 | C11.2 6.3,93.01 MS2.4 | C11.2 8.45,94.17 8.64,93.98 11.04,93.98 12.04,94.98 12.04,96.38 12.21,96.55 IC4.15 13.34,94.93 10.66,92.25 v11.8,91.11 | IC4.28 21.79,98.99 C5.1 | U1.1 22.46,10.31 C44.2 22.34,10.19 22.34,1.51 18.79,1.51 18.55,1.75 18.55,2.5 P4.8 P4.6 15.89,2.76 P4.4 | C42.2 7.55,12.87 C18.2 | C9.1 8.48,78.91 R16.2 8.48,75.16 7.77,74.45 7.77,73.16 7.9,73.03 9.09,73.03 9.23,73.16 9.23,74.21 10.3,75.28 10.78,75.28 10.91,75.41 10.91,75.87 12.04,77 IC2.3 11.65,77.74 11.3,77.74 11.17,77.88 11.17,78.67 11.3,78.8 13.6,78.8 14.13,78.27 16.18,78.27 | R17.2 20.95,79.08 | 20.95,79.08 C10.1 | IC4.11 15.29,87.13 16.29,87.13 v16.39,87.03 | C24.1 13.9,85.38 14.74,85.38 v16.39,87.03 | 16.18,78.27 IC2.5 18.22,79.26 18.22,81.91 18.36,82.05 19.85,82.05 19.98,81.91 19.98,80.05 20.95,79.08 | 16.18,78.27 15.44,77.53 C17.1 | C43.1 C57.1 | C57.1 | 12.9,21.94 IC3.3 14.7,21.94 15.6,22.84 15.6,22.96 | C57.1 18.67,25.8 13.65,25.8 IC10.3 13.56,30.41 13.56,31.04 13.3,31.3 12.44,31.3 12.34,31.2 IC10.5 | R2.2 24.71,25.05 22.39,25.05 22.39,23.21 IC3.5 18.59,23.14 17.32,23.14 17.12,22.94 v17.12,21.36 17.12,21.44 15.6,22.96 | v24.74,36.46 22.83,36.46 22.79,36.5 v22.77,36.5 | C19.1 26.97,22.17 28.52,20.62 28.52,20.04 v28.46,19.98 | v20.36,37.14 20.44,37.06 20.44,36.59 | IC10.12 IC10.11 | IC10.11 IC10.10 | IC10.11 12.99,47.21 13.22,47.44 13.22,47.46 v13.18,47.5 | v15.31,47.45 15.28,47.48 15.26,47.48 | C18.2 7.55,14.13 2.41,8.99 GND.1
  Bottom 0.152: 7.55,14.67 C18.2 | 8.28,19.86 6.53,19.86 R1.2 7.92,23.16 8.74,23.16 9.53,23.94 9.88,23.94 9.94,23.88 C20.2 | C31.2 21.55,99.25 C5.1 | v16.39,87.03 17.76,87.03 18.63,86.16 21.16,86.16 | C20.2 | 15.6,22.96 15.6,24.12 11.96,24.12 C20.2
  Bottom 0.254: P4.5 15.04,5.3 13.24,7.1 13.24,11.45 C39.1 | R2.2 C19.1 | P4.7 18.55,5.15 | 18.55,5.15 18.55,2.5 | P4.5 16.02,5.1 | 16.02,5.1 16.02,2.88 15.89,2.76 | P4.5 16.16,5.15 18.55,5.15 | 16.02,5.1 15.82,5.3 P4.3 13.47,5.71 12.34,6.85 10.19,6.85 8.29,8.75 C42.2
  pour Top: 30.04,108 0.04,108 0.04,0 -0.06,-0.1 29.99,-0.1 30.04,0
  pour Bottom: 30.04,108 30.04,-0.05 0.09,-0.05 0.09,108
LIN
  Bottom 0.152: IC4.20 16.36,96.32 16.36,93.89 12.46,89.98 6.64,89.98 5.78,89.13 4.09,89.13 3.79,88.83 3.79,86.68 6.29,86.68 7.2,85.77 7.2,84.72 7.48,84.44 10.81,84.44 10.87,84.38 10.99,84.38 11.12,84.25 11.12,83.08 11.14,83.06 11.14,82.58 12.44,81.28 17.14,81.28 18.45,82.58 20.49,82.58 21,82.07 C13.1
LOUT
  Bottom 0.152: C3.2 9.97,86.66 10.73,87.42 13.92,87.42 13.92,87.43 14.59,87.43 14.64,87.48 IC4.12
N$1
  Bottom 0.152: R5.2 9.54,60.78 9.54,53.87 5.88,50.21 5.88,39.62 J_LIN.1
N$2
  Bottom 0.152: J_LOUT.1 2.74,16.63 3,16.37 5.83,16.37 6.03,16.56 6.03,17.67 6.16,17.8 14.02,17.8 14.09,17.73 R13.2
N$3
  Bottom 0.152: R12.2 1.63,19.17 J_ROUT.1
N$4
  Top 0.152: IC1.2 16.24,42.15 16.24,43.71 R18.2 15.87,45.05 R19.1
N$5
  Top 0.152: R22.1 11.01,44.53 R21.2 10.4,43.58 IC1.7
N$6
  Top 0.152: R24.1 10.91,33.58 R23.2 11.17,34.28 11.67,34.78 IC1.9
N$7  (via drill 0.3)
  Top 0.152: v3.81,81.92 3.81,84.14 4.76,85.09 MS2.7
  Bottom 0.152: v3.81,81.92 2.86,82.87 2.86,83.82 1.59,85.09 P1.1
N$8
  Top 0.152: R20.1 15.16,46.23 16.28,47.35 18.49,47.35 18.76,47.08 18.76,46.4 | R19.2 18.68,46.48 18.76,46.4 | IC1.1 18.02,42.43 18.89,43.3 18.89,46.27 18.76,46.4
N$9
  Top 0.152: IC1.14 18.02,35.03 17.2,34.21 R26.2 19.23,33.67 R27.1
N$10
  Top 0.152: R31.1 11.85,28.76 12.4,28.22 12.4,27.67 12.71,27.36 13.74,27.36 R30.2 14.4,26.02 14.22,25.84 12.92,25.84 11.76,24.68 IC5.6
N$11
  Top 0.152: R25.1 9.38,31.92 R24.2 8.44,32.78 8.44,34.48 IC1.8
N$12
  Top 0.152: IC5.2 16.84,25.98 R28.2 16.51,27.72 R29.1
N$13
  Top 0.152: IC5.7 10.49,26.32 | 10.49,26.32 9.98,26.82 9.98,27.2 9.2,27.98 R32.1 | 10.49,26.32 R31.2
N$14
  Top 0.152: R37.1 14.74,12.41 R36.2 15.25,16.3 15.57,16.3 16.1,16.83 16.1,17.44 IC5.13
N$15
  Top 0.152: R40.1 2.7,24.4 2.7,24.85 1.57,25.98 CVIN(100K)2.1
  Bottom 0.152: C53.1 11.15,38.28 R58.1 11.69,37.74 IC10.9 11.96,35.9 11.96,35.58 12.66,34.88 15.41,34.88 18.88,38.35 18.88,39.6 19.27,39.99 19.81,39.99 21.34,38.47 21.34,26.59 21.45,26.47 21.45,25.05 3.81,25.05 1.99,26.87 CVIN(100K)2.1
N$16
  Top 0.152: IC5.1 18.11,24.07 19.39,25.35 19.39,28.19 R29.2 17.73,29.85 14.84,29.85 14.4,29.41 R30.1
N$17  (via drill 0.35)
  Top 0.152: R3.1 2.73,34.51 CVIN(100K)0.1 6.53,34.51 8.06,36.04 v8.06,36.68
  Bottom 0.152: C49.1 R46.1 14.29,29.11 IC10.2 14.28,30.82 8.42,36.68 v8.06,36.68
N$18
  Top 0.152: R35.1 7.94,14.16 R34.2 11.76,15.95 IC5.9
N$19
  Top 0.152: R39.1 2.74,26.75 2.74,27.35 1.57,28.52 CVIN(100K)1.1
  Bottom 0.152: IC10.6 11.69,29.6 11.35,29.26 R47.1 11.3,28.42 C50.1 10.44,25.46 4.84,25.46 1.57,28.73 CVIN(100K)1.1
N$20
  Top 0.152: R37.2 17.61,14.11 R38.1 18.11,14.6 IC5.14
N$21
  Top 0.152: R41.1 2.68,21.99 2.68,22.33 1.53,23.48 CVIN(100K)3.1
  Bottom 0.152: IC10.13 14.29,35.25 14.22,35.18 15.28,35.18 16.08,35.98 R59.1 15.98,38.37 C54.1 20.18,40.36 21.64,38.9 21.64,26.72 21.76,26.6 21.76,24.62 1.78,24.62 CVIN(100K)3.1
N$22
  Top 0.152: R21.1 11.94,46.23 R20.2 11.67,42.56 IC1.6
N$23
  Top 0.152: 7.68,12.42 7.21,12.42 6.68,12.95 6.68,14.75 10.11,18.18 IC5.8 | 7.68,12.42 R35.2 | R36.1 11.79,12.39 10.98,13.2 10.98,13.25 10.93,13.3 8.38,13.3 7.68,12.6 7.68,12.42
N$24
  Top 0.152: R18.1 17.57,42.92 17.49,42.84 17.49,40.45 17.62,40.31 18.41,40.31 19.23,41.13 19.23,41.2 19.77,41.73 20.4,41.73 21.58,40.55 23.64,40.55 26.34,37.85 26.9,37.85 27.7,37.06 U$1.8
N$25
  Top 0.152: CVOUT1.1 2.95,47.31 5.68,44.58 R22.2
N$26
  Top 0.152: U$2.8 23.43,38.66 23.43,32.71 18.6,32.71 18.47,32.58 18.47,31.39 19.76,30.09 19.76,23.31 18.5,22.05 17.71,22.05 17.58,22.18 17.58,24.57 18.21,25.21 R28.1
N$27  (via drill 0.35)
  Top 0.152: R27.2 20.09,31.14 20.09,21.9 17.58,19.39 17.58,16.36 17.34,16.12 16.01,16.12 v15.21,15.33
  Bottom 0.152: CVOUT2.1 3.44,15.98 5.99,15.98 6.53,16.52 6.74,16.52 7.26,17.04 11.88,17.04 13.58,15.34 v15.2,15.34 v15.21,15.33
N$28
  Top 0.152: R26.1 16.77,31.97 R25.2 16.75,35.26 IC1.13
N$29
  Top 0.152: R32.2 7.22,28.59 7.22,30.42 6.28,31.36 5.05,31.36 4.44,31.97 CVOUT3.1
N$30
  Bottom 0.152: MS2.8 4.76,82.55 4.45,82.23 4.45,81.6 4.13,81.28 2.22,81.28 2.22,81.92 1.59,82.55 P2.1
N$31  (via drill 0.35)
  Top 0.152: v10.74,58.85 9.99,59.6 v9.99,67.38
  Bottom 0.152: J_RIN.1 1.56,37.12 6.42,37.12 6.42,48.67 10.74,52.98 v10.74,58.85 | v9.99,67.38 9.99,69.1 R4.2
N$32
  Bottom 0.152: R8.2 8.43,71.45 8.43,70.38 | R4.1 8.43,70.38 | IC2.2 13.49,75.73 13.74,75.48 13.74,73.69 10.44,70.38 8.43,70.38
N$33
  Bottom 0.152: 18.06,8.14 D1.+
  Bottom 0.254: P4.10 P4.9 18.25,8.14 18.06,8.14
N$34
  Top 0.152: R38.2 16.32,11.12 1.98,11.12 CVOUT4.1
N$35
  Bottom 0.152: MS2.9 4.76,80.33 1.59,80.33 P3.1
N$36
  Bottom 0.152: R8.1 10.18,72.1 R14.2 10.85,74.46 IC2.1
N$37
  Bottom 0.152: C12.2 10.1,79.13 C9.2 10.18,78.91 R16.1 R14.1
N$38
  Bottom 0.152: MS2.14 4.76,67.63 2.86,69.53 2.86,76.2 1.59,77.47 P5.1
N$39
  Bottom 0.152: MS2.15 4.76,65.09 1.59,68.26 1.59,74.93 P6.1
N$40
  Bottom 0.152: IC2.6 17.95,77 18.52,76.43 18.52,76.34 R9.2 20.28,75.24 21.09,74.43 22.84,74.43 22.84,72.43 22.25,71.84 R5.1
N$41
  Top 0.152: MS2.17 25.08,62.55 23.81,63.82 23.81,73.03 24.77,73.98 25.72,73.98 26.67,74.93 26.67,81.6 24.77,81.6 23.5,82.87 23.5,96.2 28.26,96.2 28.57,96.52 28.57,97.47 6.03,97.47 5.4,96.84 4.45,96.84 1.59,93.98 1.59,93.03 P7.1
N$42
  Bottom 0.152: R15.2 21.74,73.54 R9.1 18.73,73.54 18.69,73.58 18.69,74.78 17.74,75.73 IC2.7
N$43
  Bottom 0.152: Q1.2 19.9,99.31 C5.2 19.84,98.39 20.49,97.73 IC4.26
N$44
  Bottom 0.152: Q1.1 10.25,99.54 C4.2 17.74,99.48 17.84,99.38 17.84,99.18 19.04,97.98 19.44,97.98 19.84,97.58 IC4.25
N$45
  Bottom 0.152: C13.2 19.25,80.92 C10.2 R17.1 20.28,76.03 21.1,76.03 R15.1
N$46
  Bottom 0.152: R12.1 5.3,18.24 5.36,18.3 9.58,18.3 9.69,18.41 C7.1 9.7,19.13 R10.2 13.56,19.13 IC3.1
N$47
  Bottom 0.152: D1.- 14.73,10.15 F1.2
N$48
  Bottom 0.152: IC3.2 11.91,20.67 R10.1 9.7,20.83 C7.2 7.64,20.82 R6.2
N$49  (via drill 0.35)
  Top 0.152: v8.47,23.81 7.51,24.77 7.51,26.87 v6.93,26.87 | v7.18,47.79 7.18,48.46 4.9,50.74 v3.87,50.74
  Bottom 0.152: C2.1 8.18,82.83 9.08,81.94 9.08,80.25 8.94,80.11 7.77,80.11 7.19,79.53 7.19,54.08 3.87,50.76 v3.87,50.74 | v6.93,26.87 6.95,26.89 6.95,47.71 7.04,47.8 v7.17,47.8 v7.18,47.79 | R6.1 7.61,19.11 R1.1 5.58,19.44 4.8,20.22 4.8,21.41 7.2,23.81 v8.47,23.81
N$50  (via drill 0.3)
  Top 0.152: v28.26,67.94 25.4,65.09 MS2.18 | v27.94,96.84 7.94,96.84 5.4,94.3 4.45,94.3 2.86,92.71 2.86,91.44 2.54,91.44 1.59,90.49 P8.1
  Bottom 0.152: v28.26,67.94 27.94,68.26 v27.94,96.84
N$51  (via drill 0.3)
  Top 0.152: v4.13,99.38 28.89,99.38 28.89,96.2 28.57,95.89 23.81,95.89 23.81,84.14 25.08,82.87 MS2.25
  Bottom 0.152: v4.13,99.38 2.86,98.11 2.86,89.22 1.59,87.95 P9.1
N$53
  Top 0.152: P4.2 P4.1
  Bottom 0.152: 7.51,7.84 D2.-
  Bottom 0.254: P4.2 7.51,6.18 7.51,7.84
N$54
  Bottom 0.152: C8.1 23.1,20.43 R11.2 20.77,20.67 IC3.7 18.59,20.6 15.94,20.6 15.79,20.45 R13.1
N$55
  Bottom 0.152: IC3.6 20.82,21.94 R11.1 23.1,22.13 C8.2 23.2,24.09 R7.2
N$56
  Bottom 0.152: C11.1 10.35,97.16 C14.1 11.31,97.25 12.64,98.58 13.64,98.58 13.99,98.23 IC4.16
N$57  (via drill 0.35)
  Top 0.152: v15.26,80.09 17.49,77.86 17.49,58.73 21.34,54.88 21.34,48.8 v21.29,48.75
  Bottom 0.152: R2.1 25.54,25.92 R7.1 22.04,27.22 22.04,48 v21.29,48.75 | C3.1 10.84,82.69 10.84,82.45 13.01,80.28 15.26,80.28 v15.26,80.09
N$59
  Bottom 0.152: D2.+ 10.71,9.7 F2.2
RIN
  Bottom 0.152: C12.1 7.96,81.33 6.54,81.33 6.29,81.58 6.29,83.73 5.89,84.13 3.24,84.13 3.24,91.53 3.47,91.76 5.62,91.76 6.94,90.44 12.24,90.44 15.94,94.14 IC4.19
ROUT
  Bottom 0.152: IC4.13 13.94,89 13.94,87.88 13.79,87.73 9.54,87.73 8.18,86.37 C2.2
SPI_CLK
  Top 0.152: MS2.11 7.18,73.07 7.18,52.76 7.34,52.6 13.79,52.6 15.29,51.1 15.29,50.17 U2.11 15.32,48.87 15.59,48.6 19.73,48.6 21.98,46.36 U$2.3 21.98,42.42 22.55,41.85 26.39,41.85 26.4,41.84 U$1.3
SPI_MISO
  Top 0.152: U2.10 14.05,51.04 13.09,52 11.96,52 11.86,52.1 6.54,52.1 6.54,68.62 MS2.13
SPI_MOSI
  Top 0.152: 21.45,42.91 21.51,42.84 21.51,42.25 22.38,41.37 25.05,41.37 U$1.4 | 21.45,42.91 U$2.4 | 21.45,42.91 21.45,46.24 19.44,48.25 13.24,48.25 12.78,48.71 U2.9 12.78,50.47 11.88,51.37 11.54,51.7 3.64,51.7 3.64,72.43 3.9,72.69 MS2.12

### Text on the board
tNames: EuroESP32 artheist, mrtof, alx1 v.01 Navrouz 2021